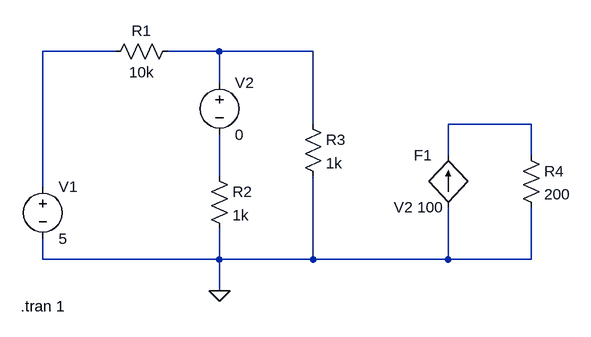
[diagram p0: schematic ex03-2.asc]
ex03-2.asc, the LTspice schematic file:
Version 4
SHEET 1 880 680
WIRE -32 -176 -144 -176
WIRE 128 -176 48 -176
WIRE 272 -176 128 -176
WIRE 128 -128 128 -176
WIRE 272 -64 272 -176
WIRE 608 -64 480 -64
WIRE 480 -16 480 -64
WIRE 608 -16 608 -64
WIRE 128 16 128 -48
WIRE -144 32 -144 -176
WIRE -144 144 -144 112
WIRE 128 144 128 96
WIRE 128 144 -144 144
WIRE 272 144 272 16
WIRE 272 144 128 144
WIRE 480 144 480 64
WIRE 480 144 272 144
WIRE 608 144 608 64
WIRE 608 144 480 144
WIRE 128 192 128 144
FLAG 128 192 0
SYMBOL voltage -144 16 R0
SYMATTR InstName V1
SYMATTR Value 5
SYMBOL res 64 -192 R90
WINDOW 0 0 56 VBottom 2
WINDOW 3 32 56 VTop 2
SYMATTR InstName R1
SYMATTR Value 10k
SYMBOL voltage 128 -144 R0
SYMATTR InstName V2
SYMATTR Value 0
SYMBOL res 112 0 R0
SYMATTR InstName R2
SYMATTR Value 1k
SYMBOL res 256 -80 R0
SYMATTR InstName R3
SYMATTR Value 1k
SYMBOL res 592 -32 R0
SYMATTR InstName R4
SYMATTR Value 200
SYMBOL f 480 64 R180
WINDOW 0 24 80 Left 2
WINDOW 3 7 0 Left 2
SYMATTR InstName F1
SYMATTR Value V2 100
TEXT -178 216 Left 2 !.tran 1

The netlist it stands for:
* ex03-2.asc
V1 N001 0 5
R1 N002 N001 10k
V2 N002 N004 0
R2 N004 0 1k
R3 N002 0 1k
R4 N003 0 200
F1 0 N003 V2 100
.tran 1
.backanno
.end